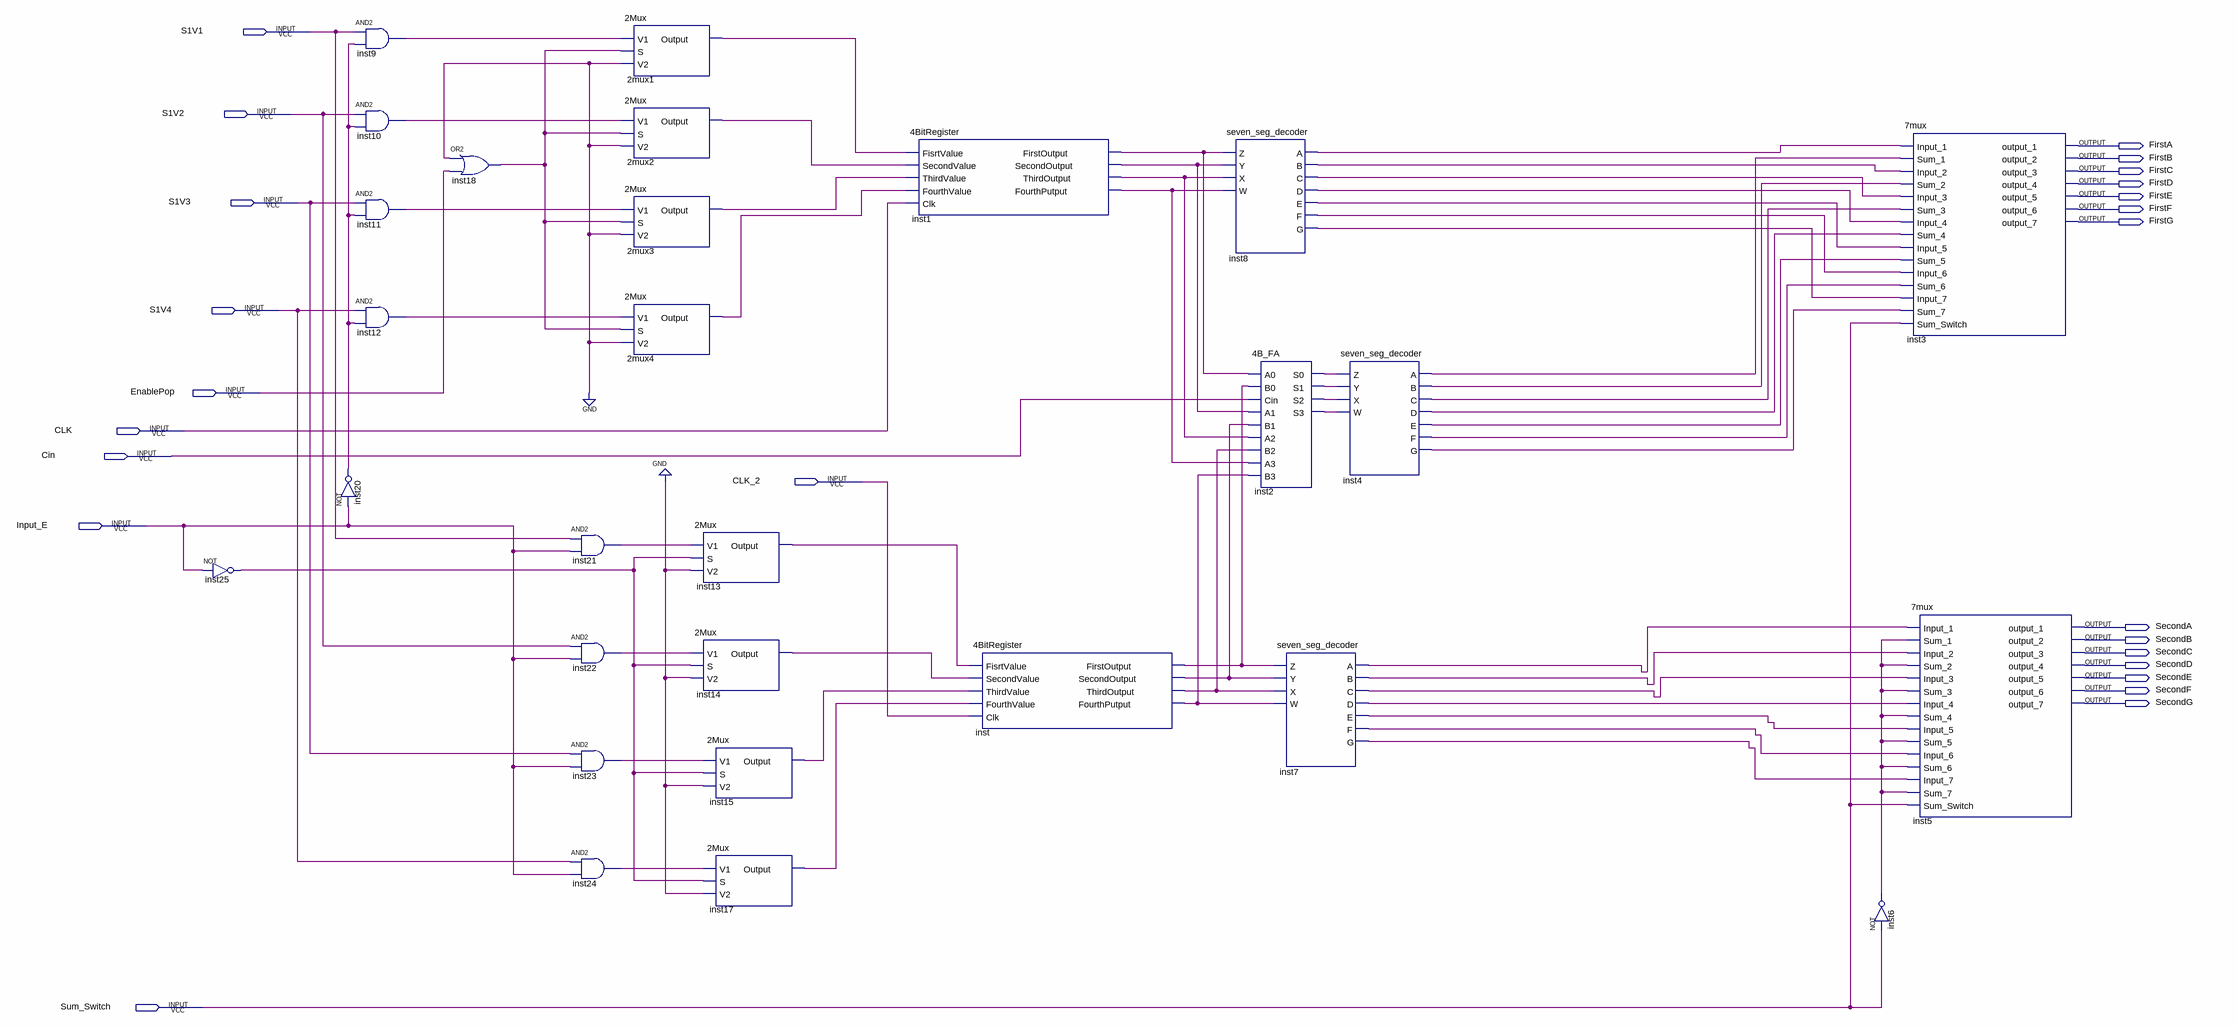
[diagram p0: schematic sheet]
// Quartus schematic FinalProject.bdf as structural Verilog: 28 symbols, 24 pins
module FinalProject (
  input  S1V1,
  input  S1V2,
  input  S1V3,
  input  S1V4,
  input  EnablePop,
  input  CLK,
  input  Cin,
  input  CLK_2,
  input  Input_E,
  input  Sum_Switch,
  output FirstA,
  output FirstB,
  output FirstC,
  output FirstD,
  output FirstE,
  output FirstF,
  output FirstG,
  output SecondA,
  output SecondB,
  output SecondC,
  output SecondD,
  output SecondE,
  output SecondF,
  output SecondG
);

  wire inst1_firstoutput, inst1_fourthputput, inst1_secondoutput, inst1_thirdoutput, inst2_s0, inst2_s1,
       inst2_s2, inst2_s3, inst4_a, inst4_b, inst4_c, inst4_d, inst4_e, inst4_f, inst4_g, inst6_out, inst7_a,
       inst7_b, inst7_c, inst7_d, inst7_e, inst7_f, inst7_g, inst8_a, inst8_b, inst8_c, inst8_d, inst8_e,
       inst8_f, inst8_g, inst9_out, inst10_out, inst11_out, inst12_out, inst13_output, inst14_output,
       inst15_output, inst17_output, inst18_out, inst20_out, inst21_out, inst22_out, inst23_out, inst24_out,
       inst25_out, inst_firstoutput, inst_fourthputput, inst_secondoutput, inst_thirdoutput, n2mux1_output,
       n2mux2_output, n2mux3_output, n2mux4_output;

  not inst25 (inst25_out, Input_E);
  and inst9 (inst9_out, S1V1, inst20_out);
  and inst10 (inst10_out, S1V2, inst20_out);
  and inst11 (inst11_out, S1V3, inst20_out);
  and inst12 (inst12_out, S1V4, inst20_out);
  not inst20 (inst20_out, Input_E);
  or inst18 (inst18_out, 1'b0, EnablePop);
  and inst21 (inst21_out, S1V1, Input_E);
  and inst22 (inst22_out, S1V2, Input_E);
  and inst23 (inst23_out, S1V3, Input_E);
  and inst24 (inst24_out, S1V4, Input_E);
  \2Mux  u_2mux1 (.V1(inst9_out), .S(inst18_out), .V2(1'b0), .Output(n2mux1_output));
  \2Mux  u_2mux2 (.V1(inst10_out), .S(inst18_out), .V2(1'b0), .Output(n2mux2_output));
  \2Mux  u_2mux3 (.V1(inst11_out), .S(inst18_out), .V2(1'b0), .Output(n2mux3_output));
  \2Mux  u_2mux4 (.V1(inst12_out), .S(inst18_out), .V2(1'b0), .Output(n2mux4_output));
  \2Mux  inst13 (.V1(inst21_out), .S(inst25_out), .V2(1'b0), .Output(inst13_output));
  \2Mux  inst14 (.V1(inst22_out), .S(inst25_out), .V2(1'b0), .Output(inst14_output));
  \2Mux  inst15 (.V1(inst23_out), .S(inst25_out), .V2(1'b0), .Output(inst15_output));
  \2Mux  inst17 (.V1(inst24_out), .S(inst25_out), .V2(1'b0), .Output(inst17_output));
  \4BitRegister  inst1 (
    .FisrtValue(n2mux1_output), .SecondValue(n2mux2_output), .ThirdValue(n2mux3_output),
    .FourthValue(n2mux4_output), .Clk(CLK), .FirstOutput(inst1_firstoutput),
    .SecondOutput(inst1_secondoutput), .ThirdOutput(inst1_thirdoutput), .FourthPutput(inst1_fourthputput));
  \4BitRegister  inst (
    .FisrtValue(inst13_output), .SecondValue(inst14_output), .ThirdValue(inst15_output),
    .FourthValue(inst17_output), .Clk(CLK_2), .FirstOutput(inst_firstoutput),
    .SecondOutput(inst_secondoutput), .ThirdOutput(inst_thirdoutput), .FourthPutput(inst_fourthputput));
  seven_seg_decoder inst8 (
    .Z(inst1_firstoutput), .Y(inst1_secondoutput), .X(inst1_thirdoutput), .W(inst1_fourthputput),
    .A(inst8_a), .B(inst8_b), .C(inst8_c), .D(inst8_d), .E(inst8_e), .F(inst8_f), .G(inst8_g));
  \4B_FA  inst2 (
    .A0(inst1_firstoutput), .B0(inst_firstoutput), .Cin(Cin), .A1(inst1_secondoutput),
    .B1(inst_secondoutput), .A2(inst1_thirdoutput), .B2(inst_thirdoutput), .A3(inst1_fourthputput),
    .B3(inst_fourthputput), .S0(inst2_s0), .S1(inst2_s1), .S2(inst2_s2), .S3(inst2_s3));
  seven_seg_decoder inst7 (
    .Z(inst_firstoutput), .Y(inst_secondoutput), .X(inst_thirdoutput), .W(inst_fourthputput), .A(inst7_a),
    .B(inst7_b), .C(inst7_c), .D(inst7_d), .E(inst7_e), .F(inst7_f), .G(inst7_g));
  seven_seg_decoder inst4 (
    .Z(inst2_s0), .Y(inst2_s1), .X(inst2_s2), .W(inst2_s3), .A(inst4_a), .B(inst4_b), .C(inst4_c),
    .D(inst4_d), .E(inst4_e), .F(inst4_f), .G(inst4_g));
  not inst6 (inst6_out, Sum_Switch);
  \7mux  inst3 (
    .Input_1(inst8_a), .Sum_1(inst4_a), .Input_2(inst8_b), .Sum_2(inst4_b), .Input_3(inst8_c),
    .Sum_3(inst4_c), .Input_4(inst8_d), .Sum_4(inst4_d), .Input_5(inst8_e), .Sum_5(inst4_e),
    .Input_6(inst8_f), .Sum_6(inst4_f), .Input_7(inst8_g), .Sum_7(inst4_g), .Sum_Switch(Sum_Switch),
    .output_1(FirstA), .output_2(FirstB), .output_3(FirstC), .output_4(FirstD), .output_5(FirstE),
    .output_6(FirstF), .output_7(FirstG));
  \7mux  inst5 (
    .Input_1(inst7_a), .Sum_1(inst6_out), .Input_2(inst7_b), .Sum_2(inst6_out), .Input_3(inst7_c),
    .Sum_3(inst6_out), .Input_4(inst7_d), .Sum_4(inst6_out), .Input_5(inst7_e), .Sum_5(inst6_out),
    .Input_6(inst7_f), .Sum_6(inst6_out), .Input_7(inst7_g), .Sum_7(inst6_out), .Sum_Switch(Sum_Switch),
    .output_1(SecondA), .output_2(SecondB), .output_3(SecondC), .output_4(SecondD), .output_5(SecondE),
    .output_6(SecondF), .output_7(SecondG));
endmodule
